# EAGLE schematic line_sensing (EAGLE 8.6.0)
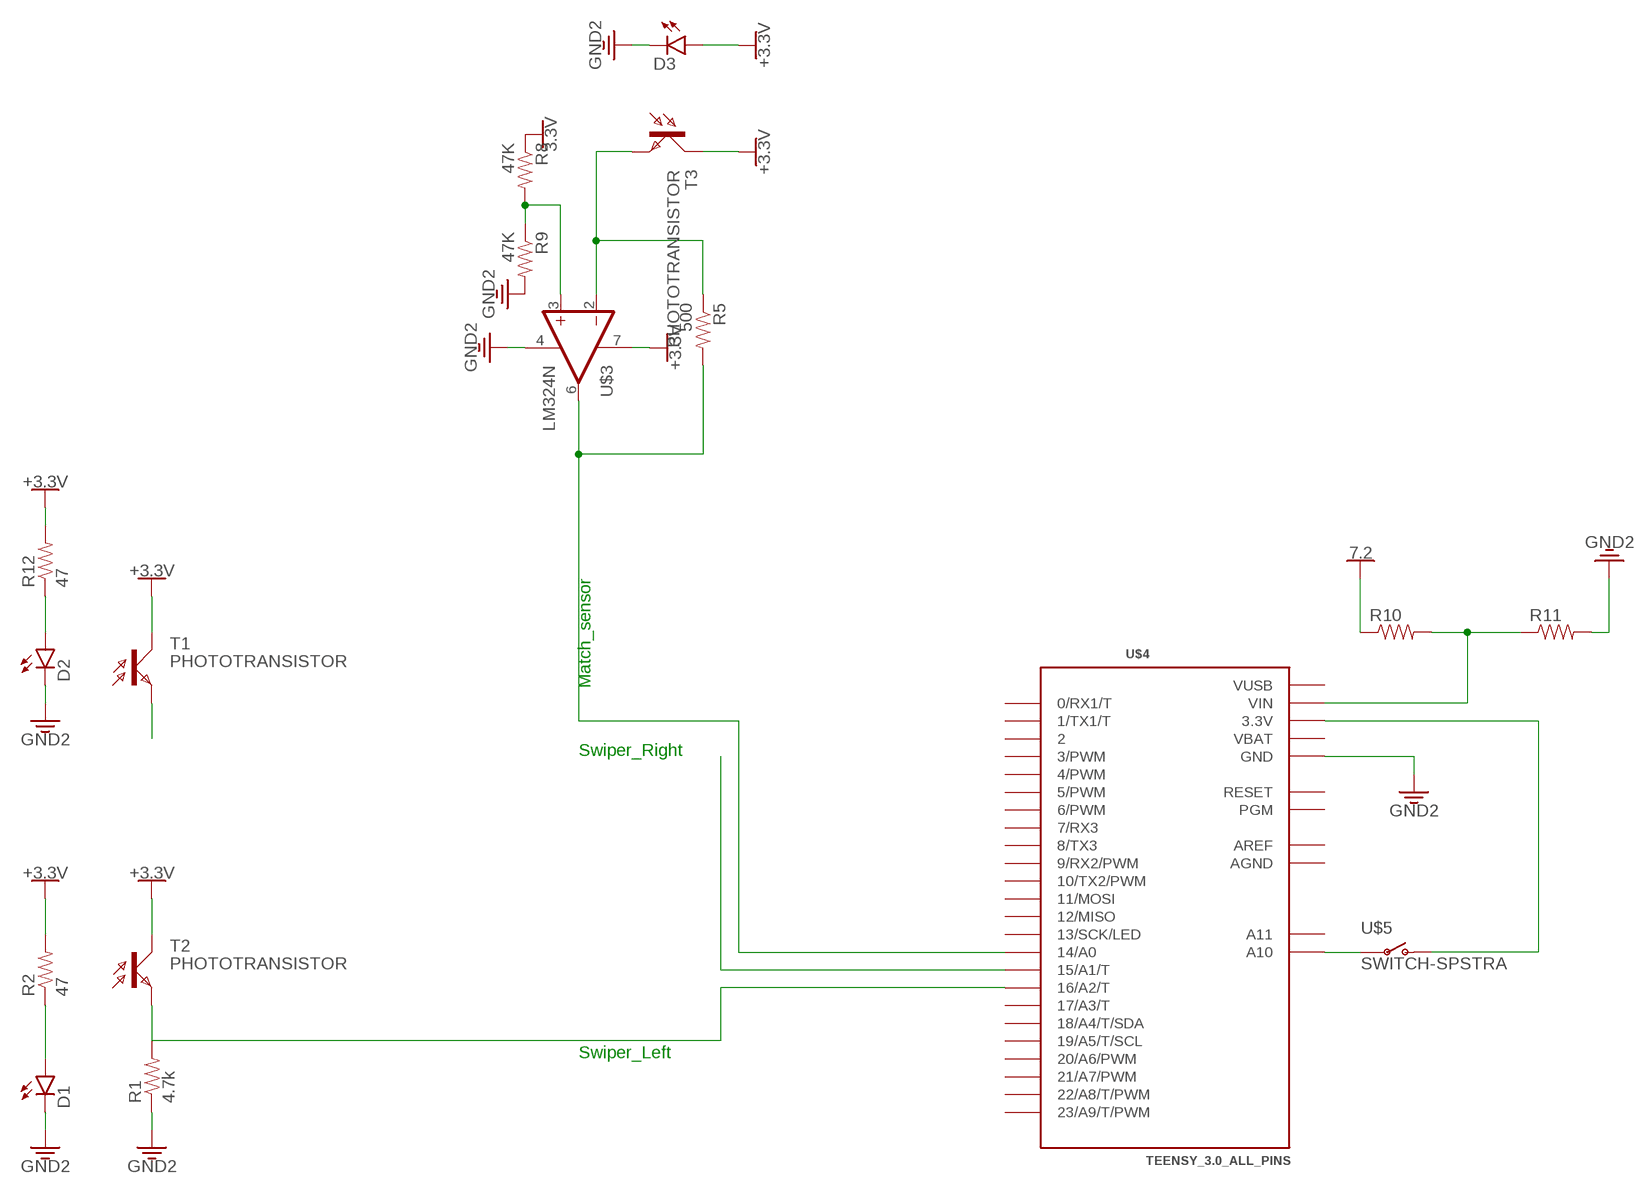
[diagram p0: schematic, sheet 1]

## Parts
D1  LED-3MM-NO_SILK  [LED3MM-NS]
D2  LED-3MM-NO_SILK  [LED3MM-NS]
D3  LED-3MM-NO_SILK  [LED3MM-NS]
R1  4.7k  RESISTOR0402-RES  [0402-RES]
R2  47  RESISTOR0402-RES  [0402-RES]
R5  500  RESISTOR0402-RES  [0402-RES]
R8  47K  RESISTOR0402-RES  [0402-RES]
R9  47K  RESISTOR0402-RES  [0402-RES]
R10  RESISTOR0402-RES  [0402-RES]
R11  RESISTOR0402-RES  [0402-RES]
R12  47  RESISTOR0402-RES  [0402-RES]
T1  PHOTOTRANSISTOR  [BPX81]
T2  PHOTOTRANSISTOR  [BPX81]
T3  PHOTOTRANSISTOR  [BPX81]
U$3  LM324N  OPAMPFINE  [S08FINE]
U$4  TEENSY_3.0_ALL_PINS  [TEENSY_3.0-3.2&LC_ALL_PINS]
U$5  SWITCH-SPSTRA  [R_SW_TH]

## Nets
3.3V: D1.K(C) D2.K(C) D3.K(C) R1.1 R9.2 R11.2 U$3.4(V-) U$4.GND U$4.GND1(GND) ; supply symbol labelled GND2
GND: D3.A R2.2 R8.1 R10.1 R12.2 T1.C T2.C T3.C U$3.7(V+) ; supply symbol labelled +3.3V, 3.3V, 7.2
N$1: D1.A R2.1
N$4: U$4.15/A1(15/A1/T)
N$6: R5.1 T3.E U$3.2(-IN)
N$7: R5.2 U$3.6(OUT) U$4.14/A0
N$8: R8.2 R9.1 U$3.3(+IN)
N$9: R10.2 R11.1 U$4.VIN
N$10: D2.A R12.1
N$11: T1.E
N$12: U$4.A10 U$5.P$4(P)
N$13: U$4.3.3V U$4.3.3V1(3.3V) U$5.P$3(O)
N$14: T2.E U$4.16/A2(16/A2/T)
Unconnected: R1.2 U$4.0(0/RX1/T) U$4.1(1/TX1/T) U$4.2 U$4.3(3/PWM) U$4.4(4/PWM) U$4.5(5/PWM) U$4.6(6/PWM) U$4.7(7/RX3) U$4.8(8/TX3) U$4.9(9/RX2/PWM) U$4.10(10/TX2/PWM) U$4.11(11/MOSI) U$4.12(12/MISO) U$4.13(13/SCK/LED) U$4.17/A3(17/A3/T) U$4.18/A4(18/A4/T/SDA) U$4.19/A5(19/A5/T/SCL) U$4.20/A6(20/A6/PWM) U$4.21/A7(21/A7/PWM) U$4.22/A8(22/A8/T/PWM) U$4.23/A9(23/A9/T/PWM) U$4.A11 U$4.PGM U$4.RESET/DAC(RESET)

## Notes on the sheet
- Match_sensor
- Swiper_Right
- Swiper_Left

## Power pins joined to a net without a drawn wire
AGND: U$4.AGND
AREF: U$4.AREF
VBAT: U$4.VBAT
VUSB: U$4.VUSB

## Library data of the parts
D1-D3 = ME210Lib_2015_v2p2:LED: LEDs Standard schematic elements and footprints for 5mm, 3mm, 1206, and 0603 sized LEDs. 5mm - Spark Fun Electronics SKU : COM-00529 (and others)
R1 R2 R5 R8-R12 = ME210Lib_2015_v2p2:RESISTOR: Resistor Basic schematic elements and footprints for 0603, 1206, and PTH resistors.
T1-T3 = ME210Lib_2015_v2p2:PHOTOTRANSISTOR: PHOTO TRANSISTOR; OC_FARNELL: unknown; OC_NEWARK: unknown
U$3 = ME210Lib_2015_v2p2:OPAMP: Generic Op-amp
U$4 = Teensy_3_and_LC_Series_Boards_v1.4:TEENSY_3.0_ALL_PINS: Teensy 3.0 board, showing all pins that are easily acessible.
U$5 = ME210Lib_2015_v2p2:SWITCH-SPST